# EAGLE design Switch_Board_v1_FIN (EAGLE 9.4.0)
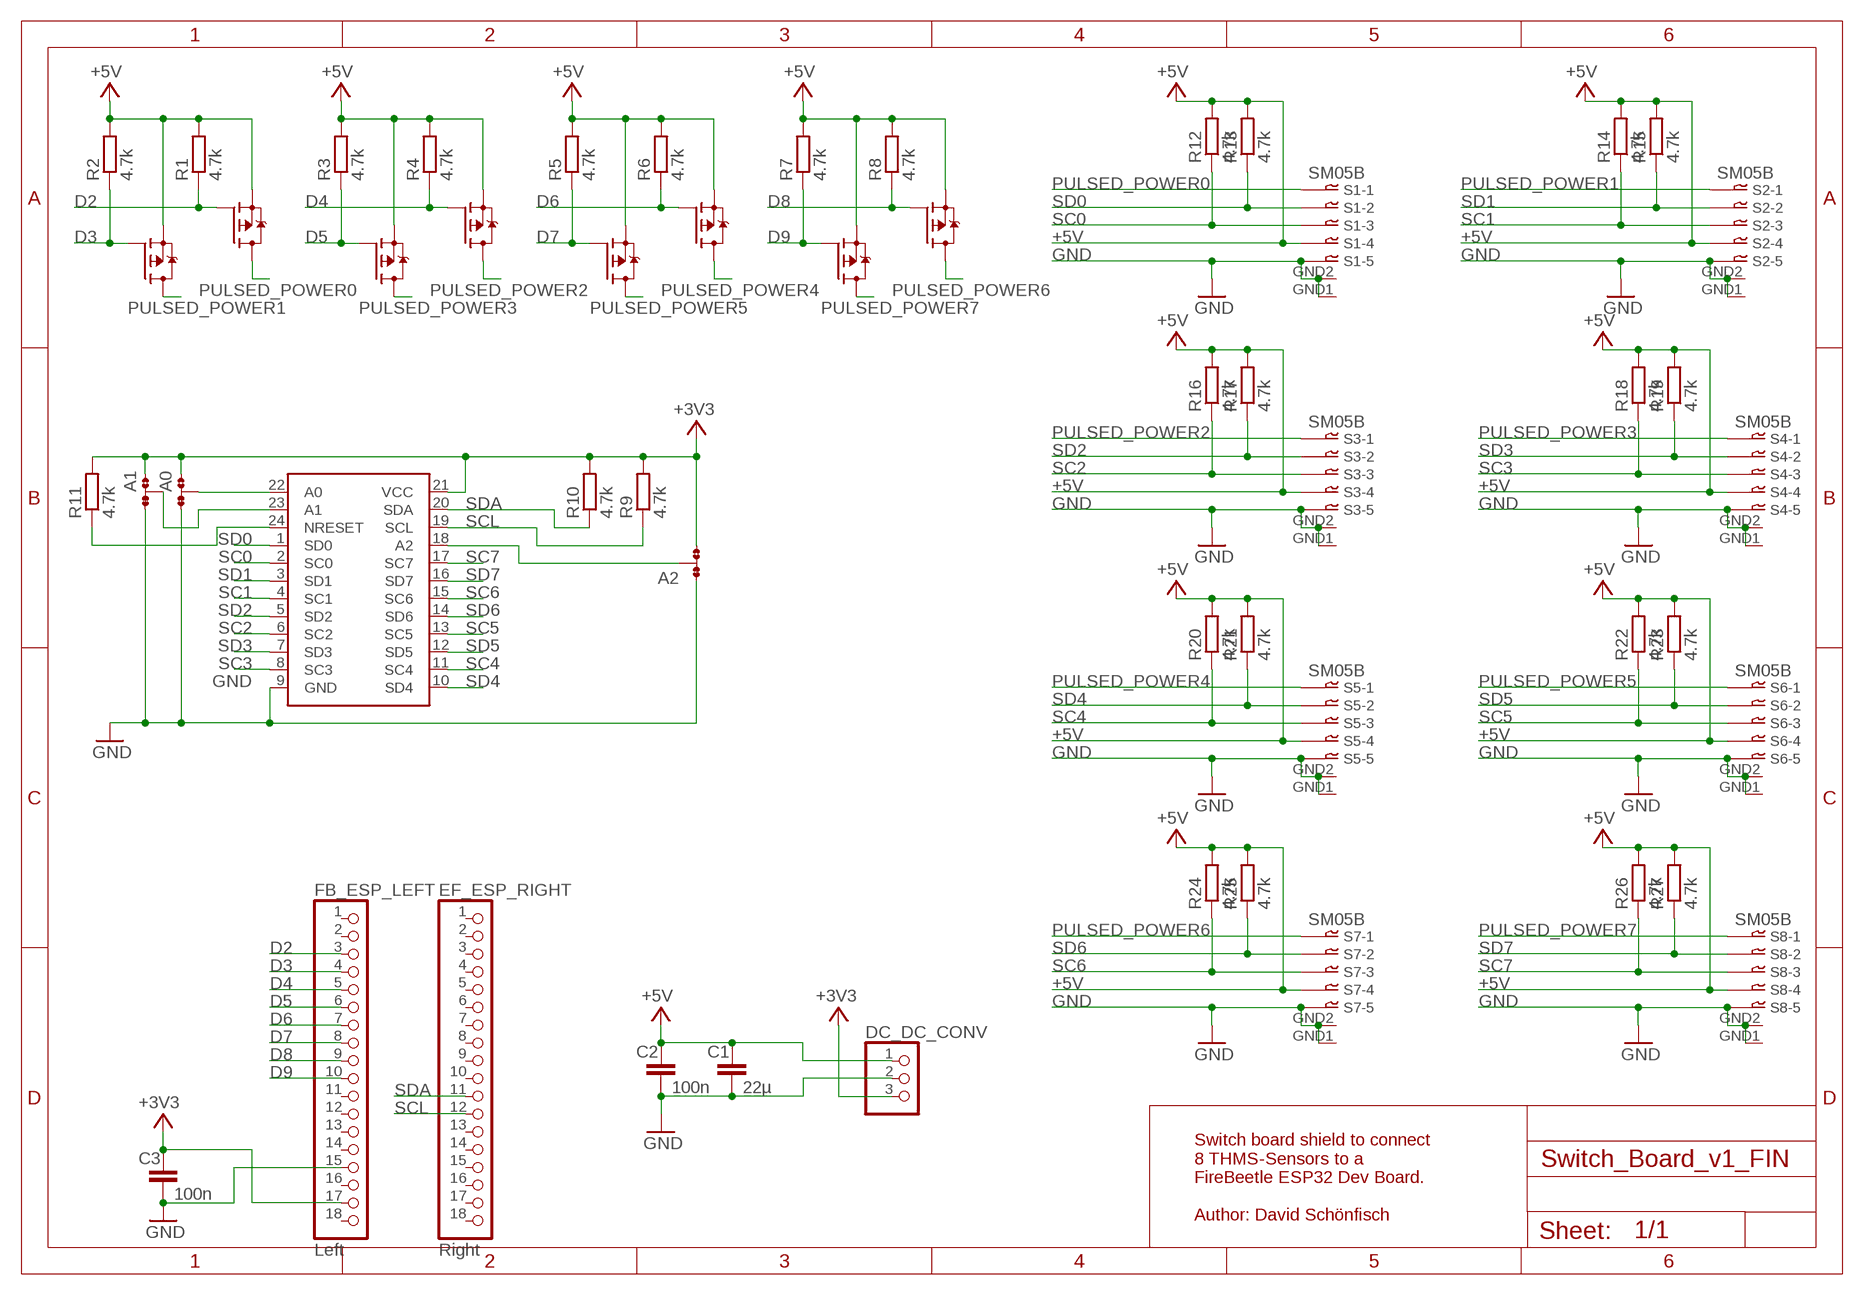
[diagram p0: schematic, sheet 1]

## Parts
A0  0R-JUMP-1CON  [D0R-JMP(D)]
A1  0R-JUMP-1CON  [D0R-JMP(D)]
A2  0R-JUMP-1CON  [D0R-JMP(D)]
C1  22µ  C-EUC0603  [C0603]
C2  100n  C-EUC0603  [C0603]
C3  100n  C-EUC0603  [C0603]
DC_DC_CONV  0  PINHD-1X3  [1X03]
EF_ESP_RIGHT  Right  PINHD-1X18  [1X18]
FB_ESP_LEFT  Left  PINHD-1X18  [1X18]
R1  4.7k  R-EU_R0603  [R0603]
R2  4.7k  R-EU_R0603  [R0603]
R3  4.7k  R-EU_R0603  [R0603]
R4  4.7k  R-EU_R0603  [R0603]
R5  4.7k  R-EU_R0603  [R0603]
R6  4.7k  R-EU_R0603  [R0603]
R7  4.7k  R-EU_R0603  [R0603]
R8  4.7k  R-EU_R0603  [R0603]
R9  4.7k  R-EU_R0603  [R0603]
R10  4.7k  R-EU_R0603  [R0603]
R11  4.7k  R-EU_R0603  [R0603]
R12  4.7k  R-EU_R0603  [R0603]
R13  4.7k  R-EU_R0603  [R0603]
R14  4.7k  R-EU_R0603  [R0603]
R15  4.7k  R-EU_R0603  [R0603]
R16  4.7k  R-EU_R0603  [R0603]
R17  4.7k  R-EU_R0603  [R0603]
R18  4.7k  R-EU_R0603  [R0603]
R19  4.7k  R-EU_R0603  [R0603]
R20  4.7k  R-EU_R0603  [R0603]
R21  4.7k  R-EU_R0603  [R0603]
R22  4.7k  R-EU_R0603  [R0603]
R23  4.7k  R-EU_R0603  [R0603]
R24  4.7k  R-EU_R0603  [R0603]
R25  4.7k  R-EU_R0603  [R0603]
R26  4.7k  R-EU_R0603  [R0603]
R27  4.7k  R-EU_R0603  [R0603]
S1  SM05B  [SM05B]
S2  SM05B  [SM05B]
S3  SM05B  [SM05B]
S4  SM05B  [SM05B]
S5  SM05B  [SM05B]
S6  SM05B  [SM05B]
S7  SM05B  [SM05B]
S8  SM05B  [SM05B]
U$1  TCA9548PVQFN  [S-PVQFN-N24]
U$2  UM6J1N  [SOT363_INFINEON]
U$3  UM6J1N  [SOT363_INFINEON]
U$4  UM6J1N  [SOT363_INFINEON]
U$5  UM6J1N  [SOT363_INFINEON]

## Nets
+3V3: A0.1 A1.1 A2.1 C3.1 DC_DC_CONV.3 FB_ESP_LEFT.17 R9.2 R10.2 R11.2 U$1.21(VCC)
+5V: C1.1 C2.1 DC_DC_CONV.1 R1.2 R2.2 R3.2 R4.2 R5.2 R6.2 R7.2 R8.2 R12.2 R13.2 R14.2 R15.2 R16.2 R17.2 R18.2 R19.2 R20.2 R21.2 R22.2 R23.2 R24.2 R25.2 R26.2 R27.2 S1.4 S2.4 S3.4 S4.4 S5.4 S6.4 S7.4 S8.4 U$2.1(S) U$2.4(S) U$3.1(S) U$3.4(S) U$4.1(S) U$4.4(S) U$5.1(S) U$5.4(S)
A0: A0.2 U$1.22(A0)
A1: A1.2 U$1.23(A1)
A2: A2.2 U$1.18(A2)
D2: FB_ESP_LEFT.3 R1.1 U$2.2(G)
D3: FB_ESP_LEFT.4 R2.1 U$2.5(G)
D4: FB_ESP_LEFT.5 R4.1 U$3.2(G)
D5: FB_ESP_LEFT.6 R3.1 U$3.5(G)
D6: FB_ESP_LEFT.7 R6.1 U$4.2(G)
D7: FB_ESP_LEFT.8 R5.1 U$4.5(G)
D8: FB_ESP_LEFT.9 R8.1 U$5.2(G)
D9: FB_ESP_LEFT.10 R7.1 U$5.5(G)
GND: A0.3 A1.3 A2.3 C1.2 C2.2 C3.2 DC_DC_CONV.2 FB_ESP_LEFT.15 S1.5 S1.GND1 S1.GND2 S2.5 S2.GND1 S2.GND2 S3.5 S3.GND1 S3.GND2 S4.5 S4.GND1 S4.GND2 S5.5 S5.GND1 S5.GND2 S6.5 S6.GND1 S6.GND2 S7.5 S7.GND1 S7.GND2 S8.5 S8.GND1 S8.GND2 U$1.9(GND)
NRESET: R11.1 U$1.24(NRESET)
PULSED_POWER0: S1.1 U$2.6(D)
PULSED_POWER1: S2.1 U$2.3(D)
PULSED_POWER2: S3.1 U$3.6(D)
PULSED_POWER3: S4.1 U$3.3(D)
PULSED_POWER4: S5.1 U$4.6(D)
PULSED_POWER5: S6.1 U$4.3(D)
PULSED_POWER6: S7.1 U$5.6(D)
PULSED_POWER7: S8.1 U$5.3(D)
SC0: R12.1 S1.3 U$1.2(SC0)
SC1: R14.1 S2.3 U$1.4(SC1)
SC2: R16.1 S3.3 U$1.6(SC2)
SC3: R18.1 S4.3 U$1.8(SC3)
SC4: R20.1 S5.3 U$1.11(SC4)
SC5: R22.1 S6.3 U$1.13(SC5)
SC6: R24.1 S7.3 U$1.15(SC6)
SC7: R26.1 S8.3 U$1.17(SC7)
SCL: EF_ESP_RIGHT.12 R9.1 U$1.19(SCL)
SD0: R13.1 S1.2 U$1.1(SD0)
SD1: R15.1 S2.2 U$1.3(SD1)
SD2: R17.1 S3.2 U$1.5(SD2)
SD3: R19.1 S4.2 U$1.7(SD3)
SD4: R21.1 S5.2 U$1.10(SD4)
SD5: R23.1 S6.2 U$1.12(SD5)
SD6: R25.1 S7.2 U$1.14(SD6)
SD7: R27.1 S8.2 U$1.16(SD7)
SDA: EF_ESP_RIGHT.11 R10.1 U$1.20(SDA)
Unconnected: EF_ESP_RIGHT.1 EF_ESP_RIGHT.2 EF_ESP_RIGHT.3 EF_ESP_RIGHT.4 EF_ESP_RIGHT.5 EF_ESP_RIGHT.6 EF_ESP_RIGHT.7 EF_ESP_RIGHT.8 EF_ESP_RIGHT.9 EF_ESP_RIGHT.10 EF_ESP_RIGHT.13 EF_ESP_RIGHT.14 EF_ESP_RIGHT.15 EF_ESP_RIGHT.16 EF_ESP_RIGHT.17 EF_ESP_RIGHT.18 FB_ESP_LEFT.1 FB_ESP_LEFT.2 FB_ESP_LEFT.11 FB_ESP_LEFT.12 FB_ESP_LEFT.13 FB_ESP_LEFT.14 FB_ESP_LEFT.16 FB_ESP_LEFT.18

## Notes on the sheet
- Switch board shield to connect 
  8 THMS-Sensors to a 
  FireBeetle ESP32 Dev Board.
  
  Author: David Schönfisch

## Library data of the parts
A0 A1 A2 = jump-0r-smd_own:0R-JUMP-1CON
C1-C3 = rcl:C-EU: CAPACITOR, European symbol; SPICEPREFIX: C
DC_DC_CONV = pinhead:PINHD-1X3: PIN HEADER
EF_ESP_RIGHT FB_ESP_LEFT = pinhead:PINHD-1X18: PIN HEADER
R1-R27 = rcl:R-EU_: RESISTOR, European symbol; SPICEPREFIX: R
S1-S8 = JST_CONNECTOR_SM05B:SM05B: CONNECTOR; OC_FARNELL: unknown; OC_NEWARK: unknown
U$1 = TI_TCA9548:TCA9548
U$2-U$5 = ROHM:UM6J1N

## Net classes
1 GND: width 0.508 mm, drill 0.406 mm, clearance 0.203 mm
2 +5V: width 0.254 mm, drill 0.356 mm, clearance 0.203 mm
3 +3V3: width 0.254 mm, drill 0.356 mm, clearance 0.203 mm

## Board
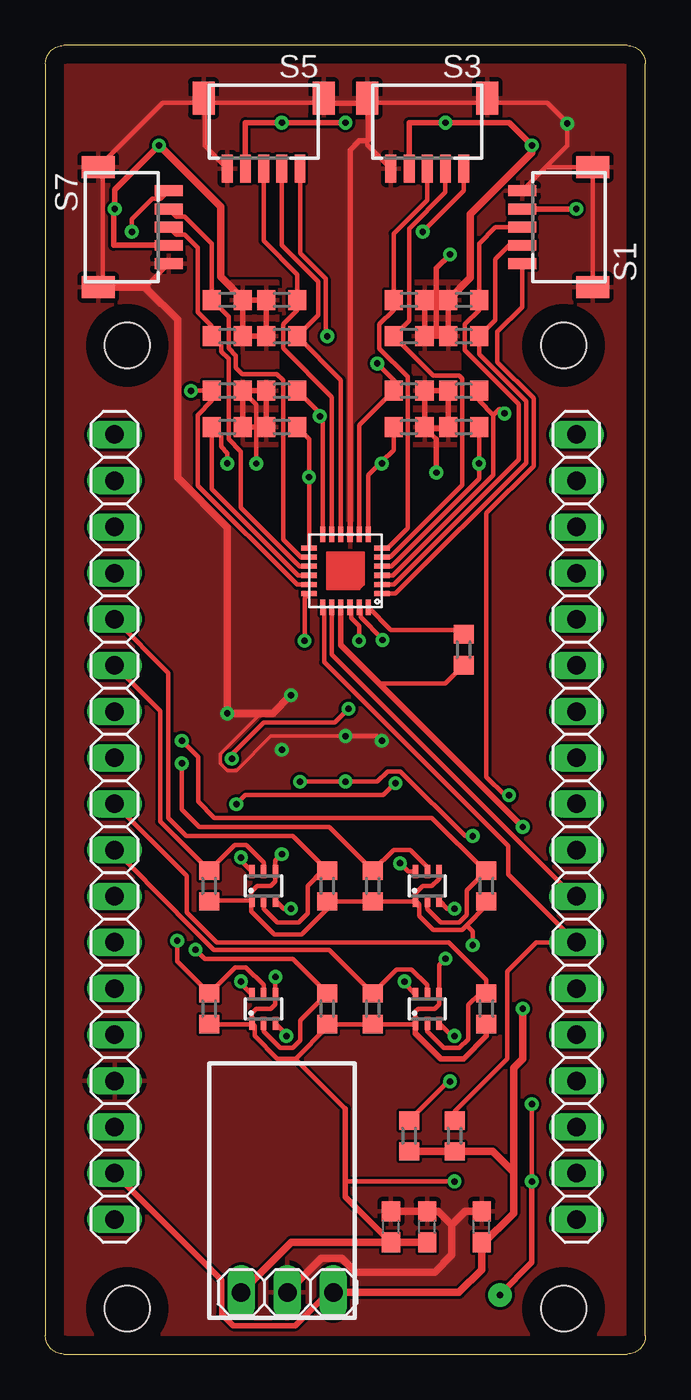
[diagram p1: board, top side]
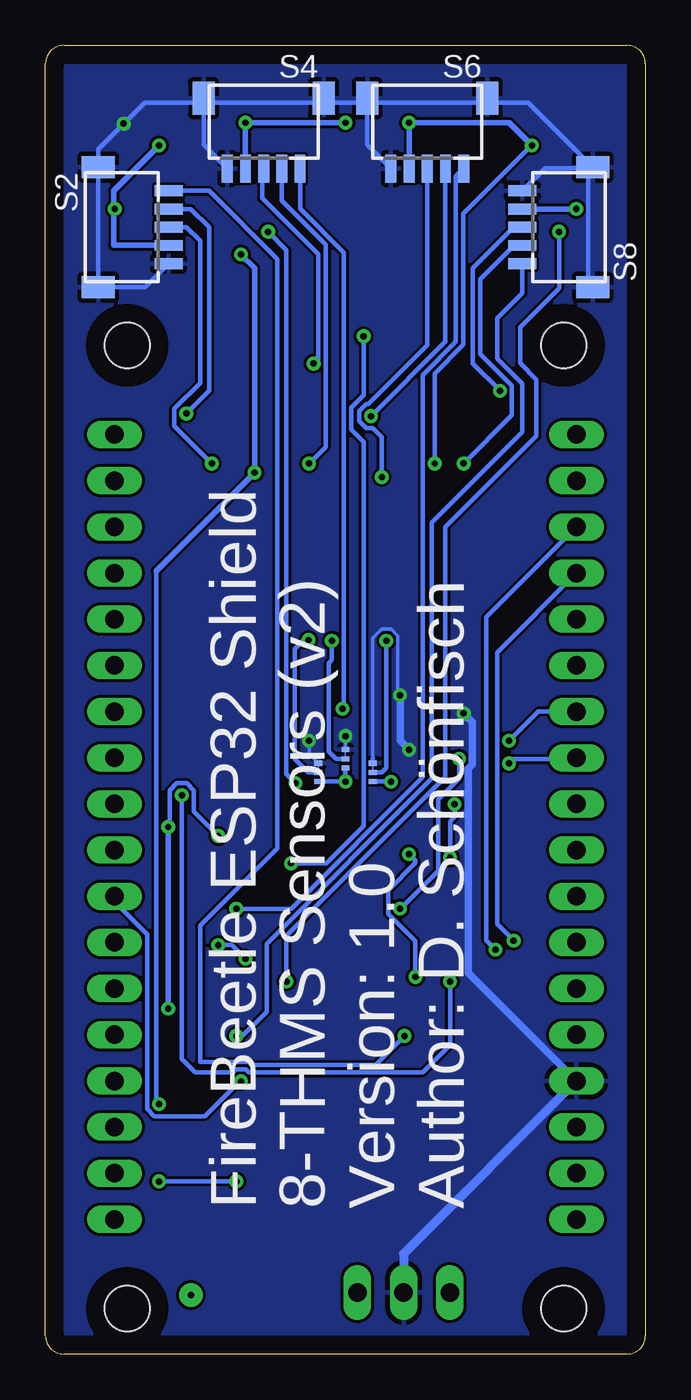
[diagram p2: board, bottom side, seen from below]

Size 33 x 72 mm. Coordinates in mm from the lower left corner, seen from the top.
Outline: 1,0 32,0 arc90 33,1 33,71 arc90 32,72 1,72 arc90 0,71 0,1 arc90 1,0
Copper layers (1*16): Top 0.035mm / dielectric 1.5mm / Bottom 0.035mm
Design rules "default *": minimum track width 6mil, minimum drill 0.35mm, track to track 6mil, track to pad 6mil, pad to pad 6mil, via to via 6mil, smd to smd 6mil, copper to edge 40mil, drill to drill 6mil, minimum pad ring 10mil, minimum via ring 8mil, stop-mask expansion 4mil, vias tented up to drill 4mm, thermal gap 10mil
Holes 2.5 mm at 4.5,2.5 28.5,2.5 4.5,55.5 28.5,55.5

### Footprints (pad centres in the part's own frame; a part is rotated, then mirrored left to right if it is on the bottom)
D0R-JMP(D) = smd 0.43 x 0.28: 1 0,0.507; 2 0,0.001; 3 0,-0.509
C0603 = smd 1.1 x 1: 1 -0.85,0; 2 0.85,0
1X03 = drill 1.016 long: 1 -2.54,0; 2 0,0; 3 2.54,0
1X18 = drill 1.016 long: 1 -21.59,0; 2 -19.05,0; 3 -16.51,0; 4 -13.97,0; 5 -11.43,0; 6 -8.89,0; 7 -6.35,0; 8 -3.81,0; 9 -1.27,0; 10 1.27,0; 11 3.81,0; 12 6.35,0; 13 8.89,0; 14 11.43,0; 15 13.97,0; 16 16.51,0; 17 19.05,0; 18 21.59,0
R0603 = smd 1 x 1.1: 1 -0.85,0; 2 0.85,0
SM05B = smd 0.6 x 1.55: 1 -2,4.775; 2 -1,4.775; 3 0,4.775; 4 1,4.775; 5 2,4.775 | smd 1.2 x 1.8: GND1 -3.3,0.9; GND2 3.3,0.9
S-PVQFN-N24 = smd 0.85 x 0.28: 1 -2,1.25; 2 -2,0.75; 3 -2,0.25; 4 -2,-0.25; 5 -2,-0.75; 6 -2,-1.25; 13 2,-1.25; 14 2,-0.75; 15 2,-0.25; 16 2,0.25; 17 2,0.75; 18 2,1.25 | smd 0.28 x 0.85: 7 -1.25,-2; 8 -0.75,-2; 9 -0.25,-2; 10 0.25,-2; 11 0.75,-2; 12 1.25,-2; 19 1.25,2; 20 0.75,2; 21 0.25,2; 22 -0.25,2; 23 -0.75,2; 24 -1.25,2
SOT363_INFINEON = smd 0.3 x 0.7: 1 -0.65,-0.8; 2 0,-0.8; 3 0.65,-0.8; 4 0.65,0.8; 5 0,0.8; 6 -0.65,0.8

### Placement (x,y rotation side)
A0  16.5,32.75 180 bottom
A1  18,32 180 bottom
A2  15,32 180 bottom
C1  21,7 90 top
C2  19,7 90 top
C3  24,7 90 top
DC_DC_CONV  13.3,3.39 0 top
EF_ESP_RIGHT  29.2,29 270 top
FB_ESP_LEFT  3.8,29 270 top
R1  15.5,19 270 top
R2  9,19 270 top
R3  9,25.75 270 top
R4  15.5,25.75 270 top
R5  18,25.75 270 top
R6  24.25,25.75 270 top
R7  18,19 270 top
R8  24.25,19 270 top
R9  22.5,12 270 top
R10  20,12 270 top
R11  23,38.75 270 top
R12  23,58 180 top
R13  23,56 180 top
R14  23,51 180 top
R15  23,53 180 top
R16  20,58 0 top
R17  20,56 0 top
R18  20,53 0 top
R19  20,51 0 top
R20  13,58 180 top
R21  13,56 180 top
R22  13,51 180 top
R23  13,53 180 top
R24  10,56 0 top
R25  10,58 0 top
R26  10,53 0 top
R27  10,51 0 top
S1  31,62 90 top
S2  31,62 270 bottom
S3  21,70 180 top
S4  21,70 180 bottom
S5  12,70 180 top
S6  12,70 180 bottom
S7  2,62 270 top
S8  2,62 90 bottom
U$1  16.5,43.1 180 top
U$2  12,19 0 top
U$3  12,25.75 0 top
U$4  21,25.75 0 top
U$5  21,19 0 top

### Tracks (layer width: path | path; a pad name or v marks a point on that pad's centre or on a via)
+3V3  (via drill 0.35)
  Top 0.254: R11.2 22,36.9 18.35,36.9 16.25,39 | v23.5,28.5 23.09,28.5 19.52,32.06 18.82,32.06 18.24,31.49 18.24,31.5 v16.5,31.5 v14.01,31.5 v14,31.49
  Top 0.305: U$1.21 16.25,39 v26.25,29 | FB_ESP_LEFT.17 9.69,4.06 9.69,2.19 10.32,1.56 13.74,1.56 15.57,3.39 DC_DC_CONV.3
  Top 0.406: DC_DC_CONV.3 22.74,3.39 24,4.65 24,6 | 24,6 C3.1 | R9.2 R10.2 24.6,11.15 25.75,10 | 25.75,10 25.75,15.75 26.25,16.25 v26.25,19 | 25.75,10 25.75,7.75 24,6
  Bottom 0.254: A2.1 v14,31.49 | v26.25,29 26.16,29.09 26.16,31.02 25.77,31.41 25.23,31.41 24.84,31.02 24.84,29.84 v23.5,28.5 | A1.1 v16.51,31.49 | v16.51,31.49 v16.5,31.5 | A0.1 v16.51,31.49
  Bottom 0.305: v26.25,29 v26.25,19
+5V  (via drill 0.35, 0.35 pad 1.3)
  Top 0.254: U$2.1 11.35,18.75 11.6,19 12.4,19 12.65,19.25 U$2.4 v12.65,20.75 | R2.2 11.3,18.15 U$2.1 | U$2.1 11.5,18.05 11.5,17.5 12.75,16.25 13.75,16.25 | 13.75,16.25 13.76,16.25 15.5,18 | R1.2 R7.2 20.3,18.15 U$5.1 20.35,18.85 20.5,19 21.4,19 21.65,19.25 U$5.4 21.65,21.4 v22,21.75 | 13.75,16.25 16.5,13.5 | R3.2 9.05,24.95 11.25,24.95 | 11.25,24.95 U$3.1 11.32,24.98 11.32,25.42 11.65,25.75 12.4,25.75 12.65,26 U$3.4 12.65,27.15 v13,27.5 | U$4.1 20.3,24.9 R5.2 R4.2 15.5,24.5 14.1,23.09 12.58,23.09 11.32,24.36 11.32,24.88 11.25,24.95 | U$4.4 21.65,26.15 21.25,25.75 20.75,25.75 20.32,25.32 20.32,24.98 U$4.1 | U$4.1 20.57,24.73 20.57,24.11 21.33,23.34 22.92,23.34 23.16,23.59 | 23.16,23.59 24.25,24.68 R6.2 | v23.5,22.5 23.5,23.25 23.16,23.59 | R19.2 20.93,50.92 21.5,50.35 | R26.2 11.6,52.25 11.6,49.48 11.59,49.48 v11.59,48.99 | 16.5,9.5 v22.5,9.5 | v26.75,9.5 v26.75,13.75
  Top 0.305: C2.1 16.5,8.65 16.5,9.5 16.5,13.5 | 15.5,18 R1.2 | R8.2 24.25,17.5 23,16.25 21.75,16.25 20.35,17.65 U$5.1 | 21.5,50.35 v21.5,48.5 | S7.4 3.75,61 3.75,62.75 3.81,62.75 v3.81,63 3.81,64.06 v6.25,66.5 | S5.4 11,67.75 v13,67.75 v16.5,67.75 | S3.4 20,67.75 v22,67.75 25.5,67.75 v26.75,66.5 | S1.4 v29.19,63 | v22.25,60.5 21.5,59.75 21.5,56 R17.2 | R16.2 21,58 | 21,58 R12.2 R13.2 R17.2 | R17.2 20.85,57.85 21,58 | 20.93,50.92 22.07,50.92 R14.2 R15.2 R18.2 R19.2 | v26.75,9.5 v26.76,9.49 26.76,5.04 25,3.28 v25,3.25 | R24.2 R25.2 11,58 R20.2 R21.2 R24.2 | R23.2 R26.2 R27.2 R22.2 R23.2
  Top 0.406: C1.1 C2.1 13.52,6.15 DC_DC_CONV.1 | v6.25,66.5 9.63,63.12 9.63,59.27 10.9,58 11,58 | R12.2 23.37,59.22 23.37,62.72 26.75,66.1 v26.75,66.5
  Bottom 0.254: v22,21.75 22.75,22.5 v23.5,22.5 | 26.91,43.09 26.91,13.98 26.75,13.82 v26.75,13.75 | v11.59,48.99 11.59,53.95 10.01,55.53 10.01,62.74 v6.25,66.5 | v22.5,9.5 v26.75,9.5 | v13,27.5 12.65,27.15 12.65,27.03 14.16,25.52 14.16,24.23 12.65,22.72 v12.65,20.75
  Bottom 0.305: 26.91,43.09 v21.5,48.5 21.5,59.75 v22.25,60.5 | v3.81,63 S8.4 | v6.25,66.5 7.5,67.75 v13,67.75 S6.4 | v16.5,67.75 v22,67.75 S4.4 | v26.75,66.5 29.25,64 29.25,63 | 29.25,63 29.25,61 S2.4 | v29.19,63 29.25,63
  pour Top: 10.25,59 10.25,50 12.75,50 12.75,59
  pour Top: 20.25,59 22.75,59 22.75,50 20.25,50
A0  (via drill 0.35)
  Top 0.254: U$1.22 16.83,41.02 16.83,40.48 17.25,40.06 v17.25,39.25
  Bottom 0.254: v17.25,39.25 17.25,38.18 17.41,38.02 17.41,33.16 17,32.75 A0.2
A1  (via drill 0.35)
  Top 0.254: U$1.23 17.33,41.02 17.33,40.56 18.54,39.35 v18.54,39.28
  Bottom 0.254: v18.54,39.28 18.79,39.28 19.29,38.78 19.29,32.75 18.54,32 A1.2
A2  (via drill 0.35)
  Top 0.254: v14.25,39.25 14.25,41.6 U$1.18
  Bottom 0.254: v14.25,39.25 14.25,32.25 14.5,32 A2.2
D2  (via drill 0.35)
  Top 0.254: U$2.2 12,17.75 12.91,16.84 13.59,16.84 14,17.25 14,18.35 R1.1 13.6,21.75 8.75,21.75 v8.25,22.25
  Bottom 0.254: v8.25,22.25 8.75,22.75 8.75,40.56 FB_ESP_LEFT.3
D3  (via drill 0.35)
  Top 0.254: U$2.5 12,20.3 11.02,21.28 10.43,21.28 R2.1 7.25,21.6 v7.25,22.75
  Bottom 0.254: v7.25,22.75 8.16,23.66 8.16,38.61 FB_ESP_LEFT.4
D4
  Top 0.254: U$3.2 12,24.5 12.75,23.75 13.93,23.75 14.42,24.24 14.42,25.77 15.26,26.6 R4.1 13.6,28.5 7.75,28.5 6.75,29.5 6.75,37.48 FB_ESP_LEFT.5
D5
  Top 0.254: U$3.5 12,27.05 11.05,28 10.4,28 R3.1 6.3,29.3 6.3,35.39 FB_ESP_LEFT.6
D6  (via drill 0.35)
  Top 0.254: U$4.2 21,24.5 21.75,23.75 22.75,23.75 23.17,24.17 23.17,25.52 R6.1 24.15,26.6 21.25,29.5 9.28,29.5 8.39,30.39 8.41,30.41 8.41,32.84 v7.5,33.75
  Bottom 0.254: FB_ESP_LEFT.7 5.9,35.35 v7.5,33.75
D7  (via drill 0.35)
  Top 0.254: U$4.5 21,26.8 20.05,27.75 19.15,27.75 R5.1 15.6,29 8.46,29 7.5,29.96 v7.5,32.5
  Bottom 0.254: v7.5,32.5 7.25,32.75 3.86,32.75 FB_ESP_LEFT.8
D8
  Top 0.254: U$5.2 21,17.75 21.91,16.84 22.77,16.84 23.25,17.32 23.25,19.2 23.9,19.85 R8.1 24.25,20.59 22.19,22.66 9.42,22.66 7.76,24.31 7.76,26.31 FB_ESP_LEFT.9
D9
  Top 0.254: U$5.5 21,20.3 20.13,21.17 19.32,21.17 R7.1 15.6,22.25 9.25,22.25 7.25,24.25 7.25,24.28 FB_ESP_LEFT.10
GND  (via drill 0.35)
  Top 0.2: v13.5,36.25 12.38,35.13 11.74,35.13 9.62,33.01 9.62,32.49 9.99,32.12 10.51,32.12 12.39,34 v16.5,34
  Top 0.254: S3.5 17.7,66.53 17.7,66.75 | 29.86,65.3 29.86,65.54 S2.GND1 | S5.5 8.75,66.47 8.75,69.05 S6.GND1 | S7.5 5.47,58.7 | 5.58,58.6 5.59,58.61 | S8.GND1 3.15,58.95 3.15,65.05 S8.GND2 6.45,68.85 8.45,68.85 S6.GND1 | S6.GND1 8.95,68.85 15.05,68.85 S6.GND2 | S6.GND2 15.55,68.85 17.45,68.85 S4.GND1 17.95,68.85 24.05,68.85 S4.GND2 24.55,68.85 27.6,68.85 28.7,67.75 v28.7,67.7 28.7,66.47 S1.5 27.52,65.3 S2.GND1 | v16.5,34 18.25,34 v18.5,33.75 | C1.2 21.61,7.85 | S2.GND1 S2.GND2 | S6.GND2 15.5,68.9 15.5,68.83
  Top 0.305: U$1.9 16.75,66.25 17.25,66.75 17.7,66.75 17.75,66.8 17.75,68.83 15.5,68.83
  Top 0.406: DC_DC_CONV.2 15.18,5.27 16.3,5.27 17.07,4.5 21.4,4.5 22.36,5.45 22.36,7.11 | C3.2 23.1,7.85 22.36,7.11 | C2.2 21.61,7.85 22.36,7.11 | S8.GND1 5.5,58.7 5.59,58.61 | 5.47,58.7 5.58,58.6 7.27,56.91 7.27,48.22 10,45.48 v10,35.25 12.5,35.25 v13.5,36.25
  Bottom 0.2: v13.5,36.25 13.62,36.37 13.62,39.51 13.99,39.88 14.51,39.88 15,39.39 15,32.8 | v18.5,33.75 18.5,33.01 A1.3 | A0.3 v16.5,34
  Bottom 0.254: S8.GND1 3.15,58.95 3.15,65.05 S8.GND2 | S8.GND2 6.45,68.85 8.45,68.85 S6.GND1 8.95,68.85 15.05,68.85 S6.GND2 | S6.GND2 15.55,68.85 17.45,68.85 S4.GND1 17.95,68.85 24.05,68.85 S4.GND2 | S4.GND2 24.55,68.85 27.55,68.85 v28.7,67.7 30.1,66.3 S2.GND1 S2.GND2 27.52,58.7 S2.5 | S6.GND2 15.3,66.53 S6.5 | S4.GND2 24.3,66.53 S4.5 | S8.5 5.53,65.25 2.95,65.25 S8.GND2 | A2.3 15,32.8
  Bottom 0.406: FB_ESP_LEFT.15 9.75,20.98 9.75,32.21 9.52,32.45 9.52,34.77 v10,35.25 | v13.5,36.25 13.5,33.75 v13,33.25
  Bottom 0.508: FB_ESP_LEFT.15 13.3,5.53 DC_DC_CONV.2
  pour Top (rank 2): 0,72 0,0 33,0 33,72
  pour Bottom (rank 2): 0,72 0,0 33,0 33,72
NRESET
  Top 0.254: U$1.24 19,39.85 22.75,39.85 R11.1
PULSED_POWER0  (via drill 0.35)
  Top 0.254: U$2.6 10.75,20.4 v10.75,20.5 | S1.1 26.23,57.61 24.86,56.24 24.86,54.59 26.85,52.6 26.85,48.87 24.25,46.27 24.25,31.75 25.25,30.75 v25.5,30.75
  Bottom 0.254: v25.5,30.75 25.5,16.25 24.75,15.5 22.68,15.5 22.52,15.66 21.98,15.66 21.82,15.5 12.25,15.5 10.75,17 v10.75,20.5
PULSED_POWER1  (via drill 0.35)
  Top 0.254: U$2.3 13.25,17.6 v13.25,17.5
  Bottom 0.254: S2.1 24,64 20.25,60.25 20.25,27.82 24.5,23.57 24.5,16.06 21.81,16.06 21.65,15.91 14.84,15.91 v13.25,17.5
PULSED_POWER2  (via drill 0.35)
  Top 0.254: U$3.6 10.75,27.15 v10.75,27.32 | S3.1 23,64 v20.75,61.75 | v10.5,30.25 11,30.75 18.59,30.75 v19.25,31.41
  Bottom 0.254: v20.75,61.75 19.75,60.74 19.75,31.91 v19.25,31.41 | v10.75,27.32 10.75,29.32 10.5,29.57 v10.5,30.25
PULSED_POWER3  (via drill 0.35)
  Top 0.254: U$3.3 13.1,24.5 v13.5,24.5 | v10.25,32.75 10.25,33 12,34.75 15.91,34.75 v16.66,35.5
  Bottom 0.254: S4.1 19,63.02 16.59,60.61 16.59,35.57 v16.66,35.5 | v13.5,24.5 11.41,26.59 11.41,30.52 10.25,31.68 v10.25,32.75
PULSED_POWER4  (via drill 0.35)
  Top 0.254: U$4.6 19.95,26.55 v19.5,27 | S5.1 14,60.58 15.41,59.17 15.41,56.09 v15.5,56
  Bottom 0.254: v15.5,56 15.5,52.75 16.19,52.06 16.19,50.87 15.51,50.19 15.51,29.06 17.57,27 v19.5,27
PULSED_POWER5  (via drill 0.35)
  Top 0.254: U$4.3 22.1,24.5 v22.5,24.5
  Bottom 0.254: S6.1 10.42,64.8 10.42,55.7 12.25,53.87 12.25,31.74 19.49,24.5 v22.5,24.5
PULSED_POWER6  (via drill 0.35)
  Top 0.254: S7.1 6.35,63.58 5.88,63.58 4.75,62.45 v4.75,61.75 | U$5.6 19.75,20.4 v19.75,20.5
  Bottom 0.254: v4.75,61.75 4.75,58.63 6.89,56.49 6.89,54.51 6,53.62 6,50.5 11,45.5 11,31.75 19.75,23 v19.75,20.5
PULSED_POWER7  (via drill 0.35)
  Top 0.254: U$5.3 22.35,17.5 v22.5,17.5
  Bottom 0.254: S8.1 6.78,58.36 8.14,56.99 8.14,54.76 6.78,53.39 6.78,50.73 11.75,45.75 11.75,31.67 20.84,22.57 20.84,18.82 22.17,17.5 v22.5,17.5
SC0
  Top 0.254: S1.3 24.75,62 23.85,61.1 R12.1 23.85,57.45 23.07,56.67 23.07,55.23 26.04,52.26 26.04,49.2 19.16,42.33 18.52,42.33 U$1.2
SC1  (via drill 0.35)
  Top 0.254: U$1.4 18.52,43.33 19.02,43.33 23.85,48.16 v23.85,49 R14.1
  Bottom 0.254: v23.85,49 25.91,51.06 25.91,52.02 24.5,53.43 24.5,61.25 25.25,62 S2.3
SC2
  Top 0.254: S3.3 21,63.5 19.15,61.65 R16.1 19.15,57.45 18.37,56.67 18.37,55.33 19.93,53.77 19.93,45.45 18.83,44.35 U$1.6
SC3  (via drill 0.35)
  Top 0.254: U$1.8 17.25,51.1 R18.1 19.25,53.1 19.25,53.5 v18.25,54.5
  Bottom 0.254: S4.3 21.08,65.15 21.08,63.58 18,60.51 18,54.75 v18.25,54.5
SC4
  Top 0.254: S5.3 12,61.25 13.85,59.4 R20.1 13.85,57.45 13.07,56.67 13.07,55.33 15.75,52.66 U$1.11
SC5  (via drill 0.35)
  Top 0.254: R22.1 14.5,50.35 v14.5,48.25 U$1.13
  Bottom 0.254: S6.3 12,55.5 15.24,52.26 15.37,52.26 15.75,51.87 15.75,51.33 15.37,50.94 15,50.94 14.5,50.44 v14.5,48.25
SC6
  Top 0.254: S7.3 7.2,61.58 7.67,61.58 8.37,60.88 8.37,57.33 9.15,56.55 R24.1 9.66,55.49 9.66,55.17 10.07,54.76 10.07,50.33 10.75,49.65 10.75,46.56 13.98,43.33 14.48,43.33 U$1.15
SC7  (via drill 0.35)
  Top 0.254: U$1.17 14.48,42.33 13.84,42.33 8.37,47.8 8.37,51.67 9.15,52.45 R26.1 v8,53
  Bottom 0.254: S8.3 6.53,62 6.45,62.08 7.17,62.08 9.5,59.74 9.5,54.5 v8,53
SCL
  Top 0.254: U$1.19 15.33,41.02 15.33,38.08 25.45,27.95 25.45,26.4 EF_ESP_RIGHT.12 27,22.65 25.4,21.04 25.4,16.25 22.5,13.35 R9.1
SD0
  Top 0.254: S1.2 25.5,61 24.75,60.25 24.75,56.9 R13.1 23.85,55.02 26.44,52.43 26.44,49.03 19.24,41.83 18.52,41.83 U$1.1
SD1  (via drill 0.35)
  Top 0.254: R15.1 23.85,52.45 24.63,51.67 | U$1.3 18.52,42.83 19.09,42.83 24.63,48.37 24.63,51.67 | 24.63,51.67 24.96,52 25,52 v25.25,51.75
  Bottom 0.254: v25.25,51.75 24,53 24,62 25,63 S2.2
SD2
  Top 0.254: S3.2 22,63.92 20,61.92 20,56.85 R17.1 21.32,53.83 22.77,53.83 22.93,53.67 22.93,47.82 18.97,43.86 18.51,43.86 U$1.5
SD3  (via drill 0.35)
  Top 0.254: 18.5,49.1 17.75,48.35 U$1.7 | v18.5,49 18.5,49.1 | R19.1 19.15,49.75 18.5,49.1
  Bottom 0.254: v18.5,49 17.59,49.91 17.59,61.04 20,63.45 S4.2
SD4
  Top 0.254: S5.2 13,61 15,59 15,57.15 R21.1 16.25,53.6 U$1.10
SD5  (via drill 0.35)
  Top 0.254: U$1.12 15.25,51.6 R23.1 15.09,51.76 v15.09,51.6
  Bottom 0.254: v15.09,51.6 11,55.69 S6.2
SD6
  Top 0.254: S7.2 7.2,62.58 7.67,62.58 9.15,61.09 R25.1 10.07,57.08 10.07,55.33 10.48,54.93 10.48,54.27 10.83,53.92 12.73,53.92 13.07,53.58 13.07,44.82 14.06,43.83 14.48,43.83 U$1.14
SD7  (via drill 0.35)
  Top 0.254: U$1.16 14.48,42.83 13.91,42.83 9.15,47.59 R27.1 9.66,50.49 9.66,49.92 10,49.58 v10,49
  Bottom 0.254: v10,49 7.34,51.66 7.34,53.27 9.09,55.02 9.09,59.15 7.17,61.08 6.85,61.08 S8.2
SDA  (via drill 0.35)
  Top 0.254: U$1.20 15.75,38.5 29.06,25.19 EF_ESP_RIGHT.11 | R10.1 22.15,15 v22.25,15
  Bottom 0.254: EF_ESP_RIGHT.11 29.2,24.89 27.4,23.08 27.4,14.03 27.41,14.02 27.41,13.48 27.02,13.09 24.23,13.09 22.32,15 v22.25,15

### Text on the board
bNames: FireBeetle ESP32 Shield / 8-THMS Sensors (v2) / Version: 1.0 / Author: D. Schönfisch